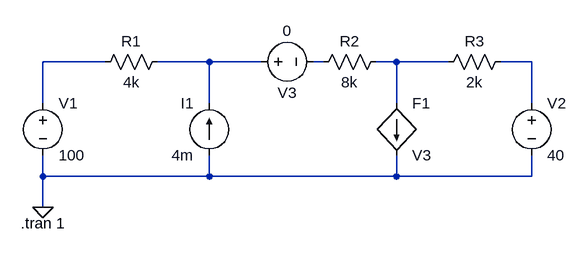
[diagram p0: schematic 3.62.asc]
3.62.asc, the LTspice schematic file:
Version 4
SHEET 1 880 680
WIRE 160 80 64 80
WIRE 320 80 240 80
WIRE 400 80 320 80
WIRE 496 80 480 80
WIRE 608 80 576 80
WIRE 688 80 608 80
WIRE 816 80 768 80
WIRE 64 144 64 80
WIRE 320 144 320 80
WIRE 608 144 608 80
WIRE 816 144 816 80
WIRE 64 256 64 224
WIRE 320 256 320 224
WIRE 320 256 64 256
WIRE 608 256 608 224
WIRE 608 256 320 256
WIRE 816 256 816 224
WIRE 816 256 608 256
WIRE 64 304 64 256
FLAG 64 304 0
SYMBOL voltage 64 128 R0
WINDOW 123 0 0 Left 0
WINDOW 39 0 0 Left 0
SYMATTR InstName V1
SYMATTR Value 100
SYMBOL current 320 224 R180
WINDOW 0 24 80 Left 2
WINDOW 3 24 0 Left 2
WINDOW 123 0 0 Left 0
WINDOW 39 0 0 Left 0
SYMATTR InstName I1
SYMATTR Value 4m
SYMBOL f 608 144 R0
SYMATTR InstName F1
SYMATTR Value V3
SYMATTR Value2 2
SYMBOL voltage 816 128 R0
WINDOW 123 0 0 Left 0
WINDOW 39 0 0 Left 0
SYMATTR InstName V2
SYMATTR Value 40
SYMBOL res 256 64 R90
WINDOW 0 0 56 VBottom 2
WINDOW 3 32 56 VTop 2
SYMATTR InstName R1
SYMATTR Value 4k
SYMBOL res 592 64 R90
WINDOW 0 0 56 VBottom 2
WINDOW 3 32 56 VTop 2
SYMATTR InstName R2
SYMATTR Value 8k
SYMBOL res 784 64 R90
WINDOW 0 0 56 VBottom 2
WINDOW 3 32 56 VTop 2
SYMATTR InstName R3
SYMATTR Value 2k
SYMBOL voltage 384 80 R270
WINDOW 0 -32 56 VBottom 2
WINDOW 3 32 56 VTop 2
WINDOW 123 0 0 Left 0
WINDOW 39 0 0 Left 0
SYMATTR InstName V3
SYMATTR Value 0
TEXT 30 328 Left 2 !.tran 1

The netlist it stands for:
* 3.62.asc
V1 N001 0 100
I1 0 N002 4m
F1 N004 0 V3 2
V2 N005 0 40
R1 N002 N001 4k
R2 N004 N003 8k
R3 N005 N004 2k
V3 N002 N003 0
.tran 1
.backanno
.end